# Altium schematic sheet controller.SchDoc
size A4
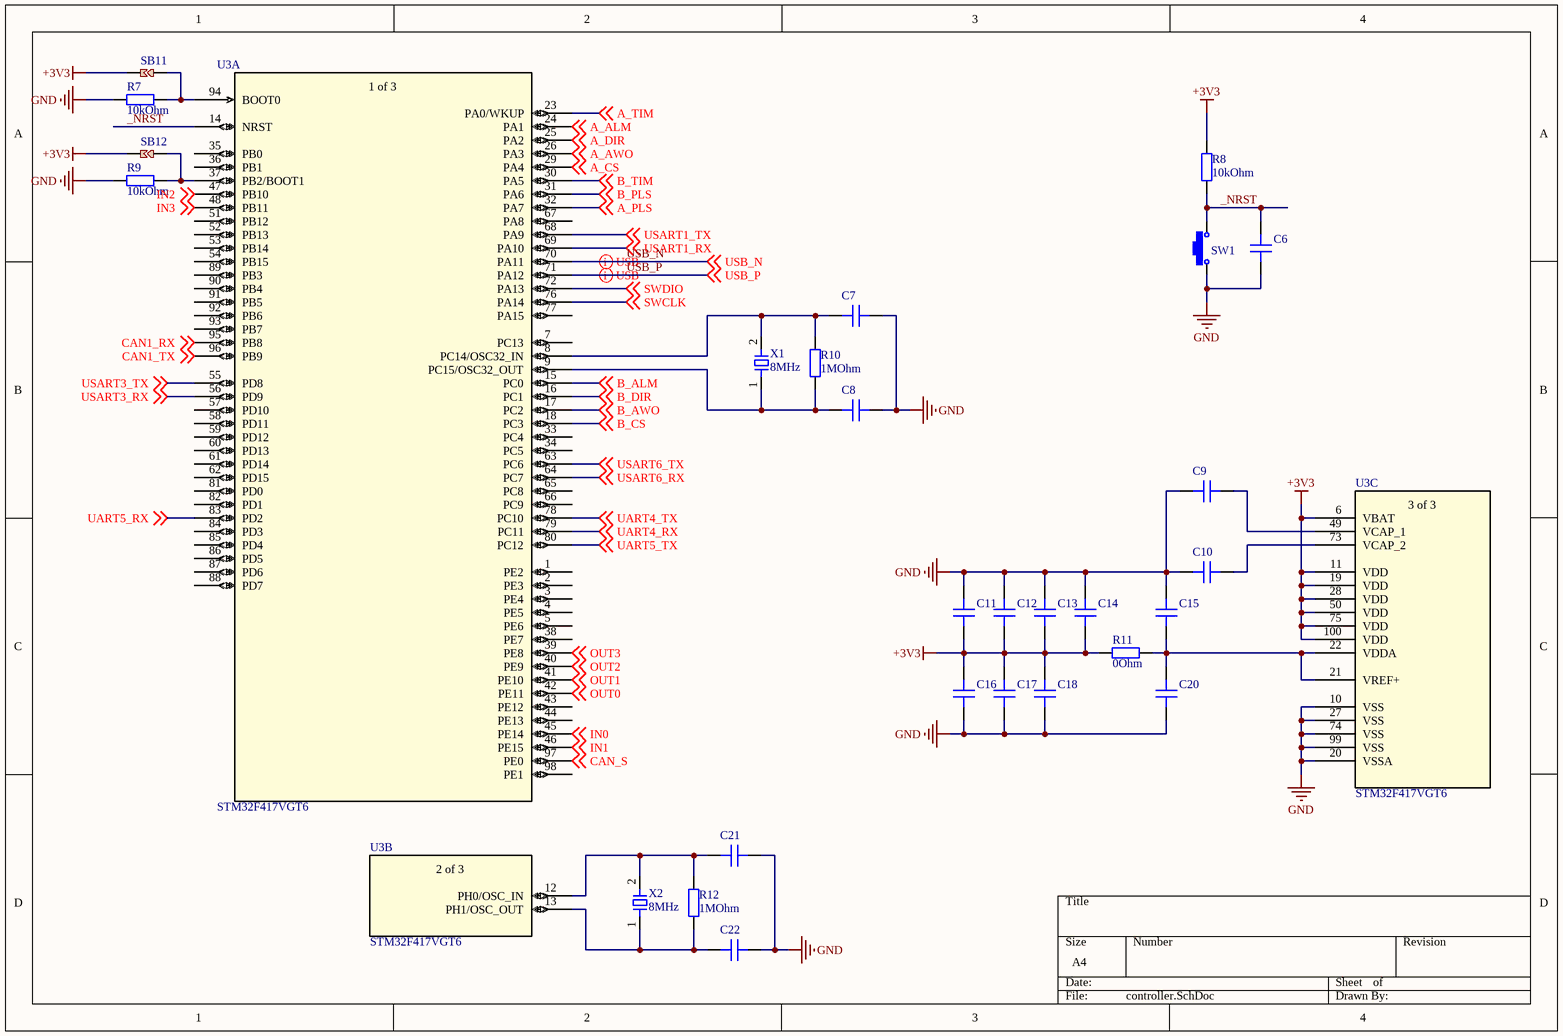
[diagram p0: controller.SchDoc]

## Parts
C6  100nF  [CAP 0805]  (value not drawn)
C7  100nF  [CAP 0805]  (value not drawn)
C8  100nF  [CAP 0805]  (value not drawn)
C9  100nF  [CAP 0805]  (value not drawn)
C10  100nF  [CAP 0805]  (value not drawn)
C11  100nF  [CAP 0805]  (value not drawn)
C12  100nF  [CAP 0805]  (value not drawn)
C13  100nF  [CAP 0805]  (value not drawn)
C14  100nF  [CAP 0805]  (value not drawn)
C15  100nF  [CAP 0805]  (value not drawn)
C16  100nF  [CAP 0805]  (value not drawn)
C17  100nF  [CAP 0805]  (value not drawn)
C18  100nF  [CAP 0805]  (value not drawn)
C20  100nF  [CAP 0805]  (value not drawn)
C21  100nF  [CAP 0805]  (value not drawn)
C22  100nF  [CAP 0805]  (value not drawn)
R7  value 10kOhm  [RES 0805]  (hidden comment: Resistor)
R8  value 10kOhm  [RES 0805]  (hidden comment: Resistor)
R9  value 10kOhm  [RES 0805]  (hidden comment: Resistor)
R10  value 1MOhm  [RES 0805]  (hidden comment: Resistor)
R11  value 0Ohm  [RES 0805]  (hidden comment: Resistor)
R12  value 1MOhm  [RES 0805]  (hidden comment: Resistor)
SB11  SB  [Solder Bridge]  (value not drawn)
SB12  SB  [Solder Bridge]  (value not drawn)
SW1  Button  [TSW SMD-3*6*2.5]  (value not drawn)
U3  STM32F417VGT6  [LQFP100-14×14mm]  (parts A,B,C of 3)
X1  8MHz  [XTAL 3215]
X2  8MHz  [XTAL 3225]

## Nets
+3V3: C11.1 C12.1 C13.1 C14.1 C16.2 C17.2 C18.2 R8.2 R11.1 SB11.1 SB12.1 U3.6(VBAT) U3.11(VDD) U3.19(VDD) U3.28(VDD) U3.50(VDD) U3.75(VDD) U3.100(VDD)
GND: C6.1 C7.2 C8.2 C9.2 C10.2 C11.2 C12.2 C13.2 C14.2 C15.2 C16.1 C17.1 C18.1 C20.1 C21.2 C22.2 R7.2 R9.2 SW1.1 U3.10(VSS) U3.20(VSSA) U3.27(VSS) U3.74(VSS) U3.99(VSS)
_NRST: C6.2 R8.1 SW1.2 U3.14(NRST)
A_ALM: U3.24(PA1) ; off-sheet A_ALM
A_AWO: U3.26(PA3) ; off-sheet A_AWO
A_CS: U3.29(PA4) ; off-sheet A_CS
A_DIR: U3.25(PA2) ; off-sheet A_DIR
A_PLS: U3.32(PA7) ; off-sheet A_PLS
A_TIM: U3.23(PA0/WKUP) ; off-sheet A_TIM
B_ALM: U3.15(PC0) ; off-sheet B_ALM
B_AWO: U3.17(PC2) ; off-sheet B_AWO
B_CS: U3.18(PC3) ; off-sheet B_CS
B_DIR: U3.16(PC1) ; off-sheet B_DIR
B_PLS: U3.31(PA6) ; off-sheet B_PLS
B_TIM: U3.30(PA5) ; off-sheet B_TIM
CAN1_RX: U3.95(PB8) ; off-sheet CAN1_RX
CAN1_TX: U3.96(PB9) ; off-sheet CAN1_TX
CAN_S: U3.97(PE0) ; off-sheet CAN_S
IN0: U3.45(PE14) ; off-sheet IN0
IN1: U3.46(PE15) ; off-sheet IN1
IN2: U3.47(PB10) ; off-sheet IN2
IN3: U3.48(PB11) ; off-sheet IN3
OUT0: U3.42(PE11) ; off-sheet OUT0
OUT1: U3.41(PE10) ; off-sheet OUT1
OUT2: U3.40(PE9) ; off-sheet OUT2
OUT3: U3.39(PE8) ; off-sheet OUT3
SWCLK: U3.76(PA14) ; off-sheet SWCLK
SWDIO: U3.72(PA13) ; off-sheet SWDIO
UART4_RX: U3.79(PC11) ; off-sheet UART4_RX
UART4_TX: U3.78(PC10) ; off-sheet UART4_TX
UART5_RX: U3.83(PD2) ; off-sheet UART5_RX
UART5_TX: U3.80(PC12) ; off-sheet UART5_TX
USART1_RX: U3.69(PA10) ; off-sheet USART1_RX
USART1_TX: U3.68(PA9) ; off-sheet USART1_TX
USART3_RX: U3.56(PD9) ; off-sheet USART3_RX
USART3_TX: U3.55(PD8) ; off-sheet USART3_TX
USART6_RX: U3.64(PC7) ; off-sheet USART6_RX
USART6_TX: U3.63(PC6) ; off-sheet USART6_TX
USB_N: U3.70(PA11) ; off-sheet USB_N
USB_P: U3.71(PA12) ; off-sheet USB_P
NetC7_1: C7.1 R10.2 U3.8(PC14/OSC32_IN) X1.2
NetC8_1: C8.1 R10.1 U3.9(PC15/OSC32_OUT) X1.1
NetC9_1: C9.1 U3.49(VCAP_1)
NetC10_1: C10.1 U3.73(VCAP_2)
NetC15_1: C15.1 C20.2 R11.2 U3.21(VREF+) U3.22(VDDA)
NetC21_1: C21.1 R12.2 U3.12(PH0/OSC_IN) X2.2
NetC22_1: C22.1 R12.1 U3.13(PH1/OSC_OUT) X2.1
NetR7_1: R7.1 SB11.2 U3.94(BOOT0)
NetR9_1: R9.1 SB12.2 U3.37(PB2/BOOT1)

Not connected (* = marked no-connect by the designer): U3 1(PE2) 2(PE3) 3(PE4) 4(PE5) 5(PE6) 7(PC13) 33(PC4) 34(PC5) 35(PB0) 36(PB1) 38(PE7) 43(PE12) 44(PE13) 51(PB12) 52(PB13) 53(PB14) 54(PB15) 57(PD10) 58(PD11) 59(PD12) 60(PD13) 61(PD14) 62(PD15) 65(PC8) 66(PC9) 67(PA8) 77(PA15) 81(PD0) 82(PD1) 84(PD3) 85(PD4) 86(PD5) 87(PD6) 88(PD7) 89(PB3) 90(PB4) 91(PB5) 92(PB6) 93(PB7) 98(PE1)

## Layout directives
differential pair: USB_N, USB_P

## Notes on the sheet
- (in symbol STM32F417VGT6, part A) 1 of 3
- (in symbol STM32F417VGT6, part B) 2 of 3
- (in symbol STM32F417VGT6, part C) 3 of 3

## Library data of the parts
C6-C18 C20-C22 = Cap: Non-polar capacitor; Published: 8-Jun-2000; LatestRevisionDate: 17-Jul-2002; LatestRevisionNote: Re-released for DXP Platform.; PackageReference: RAD-0.3; Publisher: Altium Limited; PackageDescription: Radial Cap, Thru-Hole; 2 Leads; 0.3 in Pin Spacing
R7-R12 = Res: Published: 8-Jun-2000; LatestRevisionDate: 17-Jul-2002; LatestRevisionNote: Re-released for DXP Platform.; PackageReference: AXIAL-0.4; Publisher: Altium Limited; PackageDescription: Axial Device, Thru-Hole; 2 Leads; 0.4 in Pin Spacing
SW1 = BTN: BOM名称: 3x6轻触开关; 版权归属: 黎明电子style; 学习资源: https://lmdzstyle.taobao.com/
U3 = STM32F417VGT6: No Description Available; SourceLibrary: Updates_to_database_2020-10-19; Built_By: EMA_UL_Team; Vendor: STMicroelectronics; Copyright: Copyright (C) 2018 Accelerated Designs. All rights reserved; Manufacturer_Part_Number: STM32F417VGT6; RefDes: RefDes; Type: DEV
X1 = XTAL: Passive Oscillator; BOM名称: 2脚晶振; 版权归属: 黎明电子style; 学习资源: https://lmdzstyle.taobao.com/
X2 = XTAL: Passive Oscillator; pin to pad: 2>3; BOM名称: 2脚晶振; 版权归属: 黎明电子style; 学习资源: https://lmdzstyle.taobao.com/